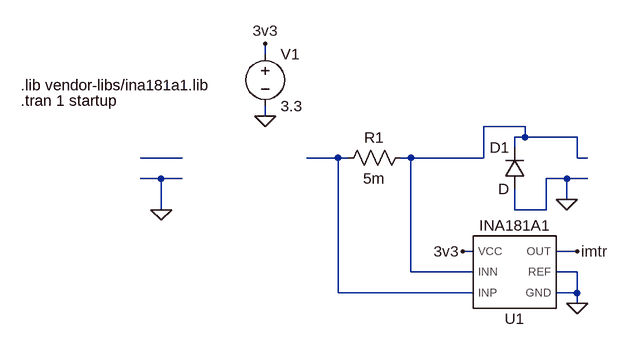
[diagram p0: schematic power-systems.asc]
power-systems.asc, the LTspice schematic file:
Version 4
SHEET 1 1000 680
WIRE 240 16 240 0
WIRE 240 112 240 96
WIRE 640 128 576 128
WIRE 640 144 640 128
WIRE 640 144 624 144
WIRE 720 144 640 144
WIRE 624 160 624 144
WIRE 112 176 48 176
WIRE 352 176 304 176
WIRE 368 176 352 176
WIRE 464 176 448 176
WIRE 576 176 576 128
WIRE 576 176 464 176
WIRE 720 176 720 144
WIRE 736 176 720 176
WIRE 80 208 48 208
WIRE 112 208 80 208
WIRE 704 208 672 208
WIRE 736 208 704 208
WIRE 704 240 704 208
WIRE 80 256 80 208
WIRE 624 256 624 224
WIRE 672 256 672 208
WIRE 672 256 624 256
WIRE 560 320 544 320
WIRE 720 320 688 320
WIRE 464 352 464 176
WIRE 560 352 464 352
WIRE 720 352 688 352
WIRE 352 384 352 176
WIRE 560 384 352 384
WIRE 720 384 720 352
WIRE 720 384 688 384
WIRE 720 400 720 384
FLAG 80 256 0
FLAG 704 240 0
FLAG 240 112 0
FLAG 240 0 3v3
FLAG 544 320 3v3
FLAG 720 320 imtr
FLAG 720 400 0
SYMBOL res 464 160 R90
WINDOW 0 0 56 VBottom 2
WINDOW 3 32 56 VTop 2
SYMATTR InstName R1
SYMATTR Value 5m
SYMBOL voltage 240 0 R0
SYMATTR InstName V1
SYMATTR Value 3.3
SYMBOL INA181A1 624 352 M180
SYMATTR InstName U1
SYMBOL diode 640 224 R180
WINDOW 0 24 64 Left 2
WINDOW 3 24 0 Left 2
SYMATTR InstName D1
TEXT -136 88 Left 2 !.tran 1 startup
TEXT -136 64 Left 2 !.lib vendor-libs/ina181a1.lib

The netlist it stands for:
* power-systems.asc
R1 N001 N003 5m
V1 3v3 0 3.3
XU1 N003 N001 3v3 0 0 imtr INA181A1  ; pins INP INN VCC GND REF OUT
D1 0 N001 D
.model D D
.lib standard.dio
.tran 1 startup
.lib vendor-libs/ina181a1.lib
.lib C:\users\lowdrant\Favorites\git\saber\hw\sims\ina181a1.lib
.backanno
.end